# Altium project RobotCtrl.PrjPcb
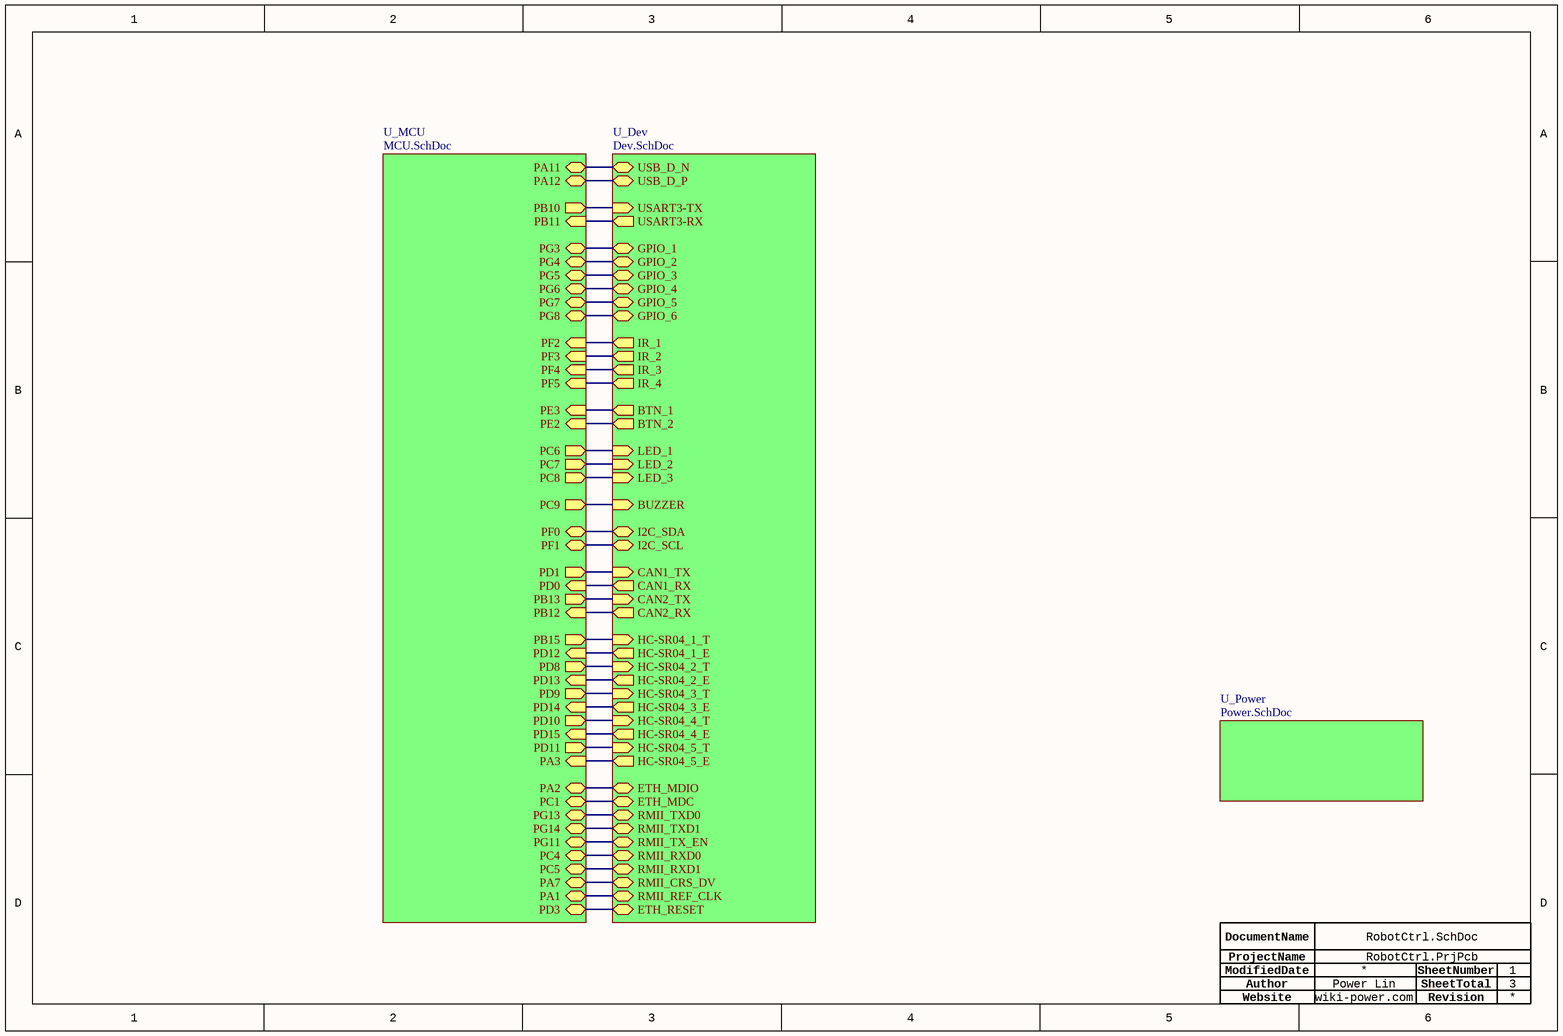
[diagram p0: RobotCtrl.SchDoc]
4 sheets, 127 parts. Net scope: hierarchical (ports join the sheet entries above them; power ports are global).
Board file: RobotCtrl.PcbDoc
Sheets:
  RobotCtrl.SchDoc
    U_Dev = Dev.SchDoc
    U_MCU = MCU.SchDoc
    U_Power = Power.SchDoc

## Sheet RobotCtrl.SchDoc
size 292 x 193 mm; Author: Power Lin; DocumentNumber: 2; SheetNumber: 1; SheetTotal: 3; Website: wiki-power.com

### Sub-sheets
U_Dev = Dev.SchDoc: USB_D_N (bidir), USB_D_P (bidir), USART3-TX (in), USART3-RX (out), GPIO_1 (bidir), GPIO_2 (bidir), GPIO_3 (bidir), GPIO_4 (bidir), GPIO_5 (bidir), GPIO_6 (bidir), BTN_1 (out), BTN_2 (out), LED_1 (in), LED_2 (in), LED_3 (in), IR_1 (out), IR_2 (out), IR_3 (out), IR_4 (out), BUZZER (in), I2C_SDA (bidir), I2C_SCL (bidir), CAN2_TX (in), CAN1_RX (out), CAN1_TX (in), CAN2_RX (out), HC-SR04_1_E (out), HC-SR04_2_T (in), HC-SR04_1_T (in), HC-SR04_5_E (out), HC-SR04_4_E (out), HC-SR04_5_T (in), HC-SR04_2_E (out), HC-SR04_4_T (in), HC-SR04_3_E (out), HC-SR04_3_T (in), RMII_TX_EN (bidir), RMII_TXD0 (bidir), ETH_RESET (bidir), RMII_TXD1 (bidir), RMII_RXD0 (bidir), RMII_RXD1 (bidir), ETH_MDIO (bidir), RMII_CRS_DV (bidir), ETH_MDC (bidir), RMII_REF_CLK (bidir)
U_MCU = MCU.SchDoc: PA11 (bidir), PA12 (bidir), PB11 (in), PB10 (out), PG8 (bidir), PG6 (bidir), PG5 (bidir), PG7 (bidir), PG4 (bidir), PG3 (bidir), PF3 (in), PF2 (in), PF5 (in), PF4 (in), PE3 (in), PE2 (in), PC7 (out), PC6 (out), PC8 (out), PC9 (out), PF0 (bidir), PF1 (bidir), PD0 (in), PB13 (out), PB12 (in), PD1 (out), PD10 (out), PA3 (in), PD8 (out), PD12 (in), PD15 (in), PD13 (in), PD11 (out), PD9 (out), PD14 (in), PB15 (out), PG11 (bidir), PC1 (bidir), PA7 (bidir), PA1 (bidir), PA2 (bidir), PG14 (bidir), PC4 (bidir), PD3 (bidir), PC5 (bidir), PG13 (bidir)
U_Power = Power.SchDoc: no entries

### Nets
USB_D_N: sheet U_Dev/USB_D_N, sheet U_MCU/PA11
USB_D_P: sheet U_Dev/USB_D_P, sheet U_MCU/PA12
NetC41_2: sheet U_Dev/BTN_1, sheet U_MCU/PE3
NetC45_2: sheet U_Dev/BTN_2, sheet U_MCU/PE2
NetIC2_9: sheet U_Dev/USART3-RX, sheet U_MCU/PB11
NetIC2_10: sheet U_Dev/USART3-TX, sheet U_MCU/PB10
NetIC3_7: sheet U_Dev/RMII_RXD1, sheet U_MCU/PC5
NetIC3_8: sheet U_Dev/RMII_RXD0, sheet U_MCU/PC4
NetIC3_11: sheet U_Dev/RMII_CRS_DV, sheet U_MCU/PA7
NetIC3_13: sheet U_Dev/ETH_MDC, sheet U_MCU/PC1
NetIC3_14: sheet U_Dev/RMII_REF_CLK, sheet U_MCU/PA1
NetIC3_15: sheet U_Dev/ETH_RESET, sheet U_MCU/PD3
NetIC3_16: sheet U_Dev/RMII_TX_EN, sheet U_MCU/PG11
NetIC3_17: sheet U_Dev/RMII_TXD0, sheet U_MCU/PG13
NetIC3_18: sheet U_Dev/RMII_TXD1, sheet U_MCU/PG14
NetP4_2: sheet U_Dev/HC-SR04_1_T, sheet U_MCU/PB15
NetP4_3: sheet U_Dev/HC-SR04_1_E, sheet U_MCU/PD12
NetP5_2: sheet U_Dev/HC-SR04_2_T, sheet U_MCU/PD8
NetP5_3: sheet U_Dev/HC-SR04_2_E, sheet U_MCU/PD13
NetP6_2: sheet U_Dev/HC-SR04_3_T, sheet U_MCU/PD9
NetP6_3: sheet U_Dev/HC-SR04_3_E, sheet U_MCU/PD14
NetP7_2: sheet U_Dev/HC-SR04_4_T, sheet U_MCU/PD10
NetP7_3: sheet U_Dev/HC-SR04_4_E, sheet U_MCU/PD15
NetP8_2: sheet U_Dev/HC-SR04_5_T, sheet U_MCU/PD11
NetP8_3: sheet U_Dev/HC-SR04_5_E, sheet U_MCU/PA3
NetP11_1: sheet U_Dev/IR_1, sheet U_MCU/PF2
NetP11_2: sheet U_Dev/IR_2, sheet U_MCU/PF3
NetP11_3: sheet U_Dev/IR_3, sheet U_MCU/PF4
NetP11_4: sheet U_Dev/IR_4, sheet U_MCU/PF5
NetP13_1: sheet U_Dev/GPIO_1, sheet U_MCU/PG3
NetP13_2: sheet U_Dev/GPIO_2, sheet U_MCU/PG4
NetP13_3: sheet U_Dev/GPIO_3, sheet U_MCU/PG5
NetP13_4: sheet U_Dev/GPIO_4, sheet U_MCU/PG6
NetP13_5: sheet U_Dev/GPIO_5, sheet U_MCU/PG7
NetP13_6: sheet U_Dev/GPIO_6, sheet U_MCU/PG8
NetR8_2: sheet U_Dev/ETH_MDIO, sheet U_MCU/PA2
NetR14_1: sheet U_Dev/BUZZER, sheet U_MCU/PC9
NetR15_1: sheet U_Dev/I2C_SCL, sheet U_MCU/PF1
NetR16_1: sheet U_Dev/I2C_SDA, sheet U_MCU/PF0
NetR22_2: sheet U_Dev/LED_1, sheet U_MCU/PC6
NetR27_2: sheet U_Dev/LED_2, sheet U_MCU/PC7
NetR28_2: sheet U_Dev/LED_3, sheet U_MCU/PC8
NetU1_73: sheet U_Dev/CAN2_RX, sheet U_MCU/PB12
NetU1_74: sheet U_Dev/CAN2_TX, sheet U_MCU/PB13
NetU1_114: sheet U_Dev/CAN1_RX, sheet U_MCU/PD0
NetU1_115: sheet U_Dev/CAN1_TX, sheet U_MCU/PD1

### Notes on the sheet
- Author
- DocumentName
- ModifiedDate
- ProjectName
- SheetNumber
- SheetTotal
- Website
- Revision

## Sheet Dev.SchDoc
size 292 x 193 mm; Author: Power Lin; DocumentNumber: 4; SheetNumber: 4; SheetTotal: 3; Website: wiki-power.com
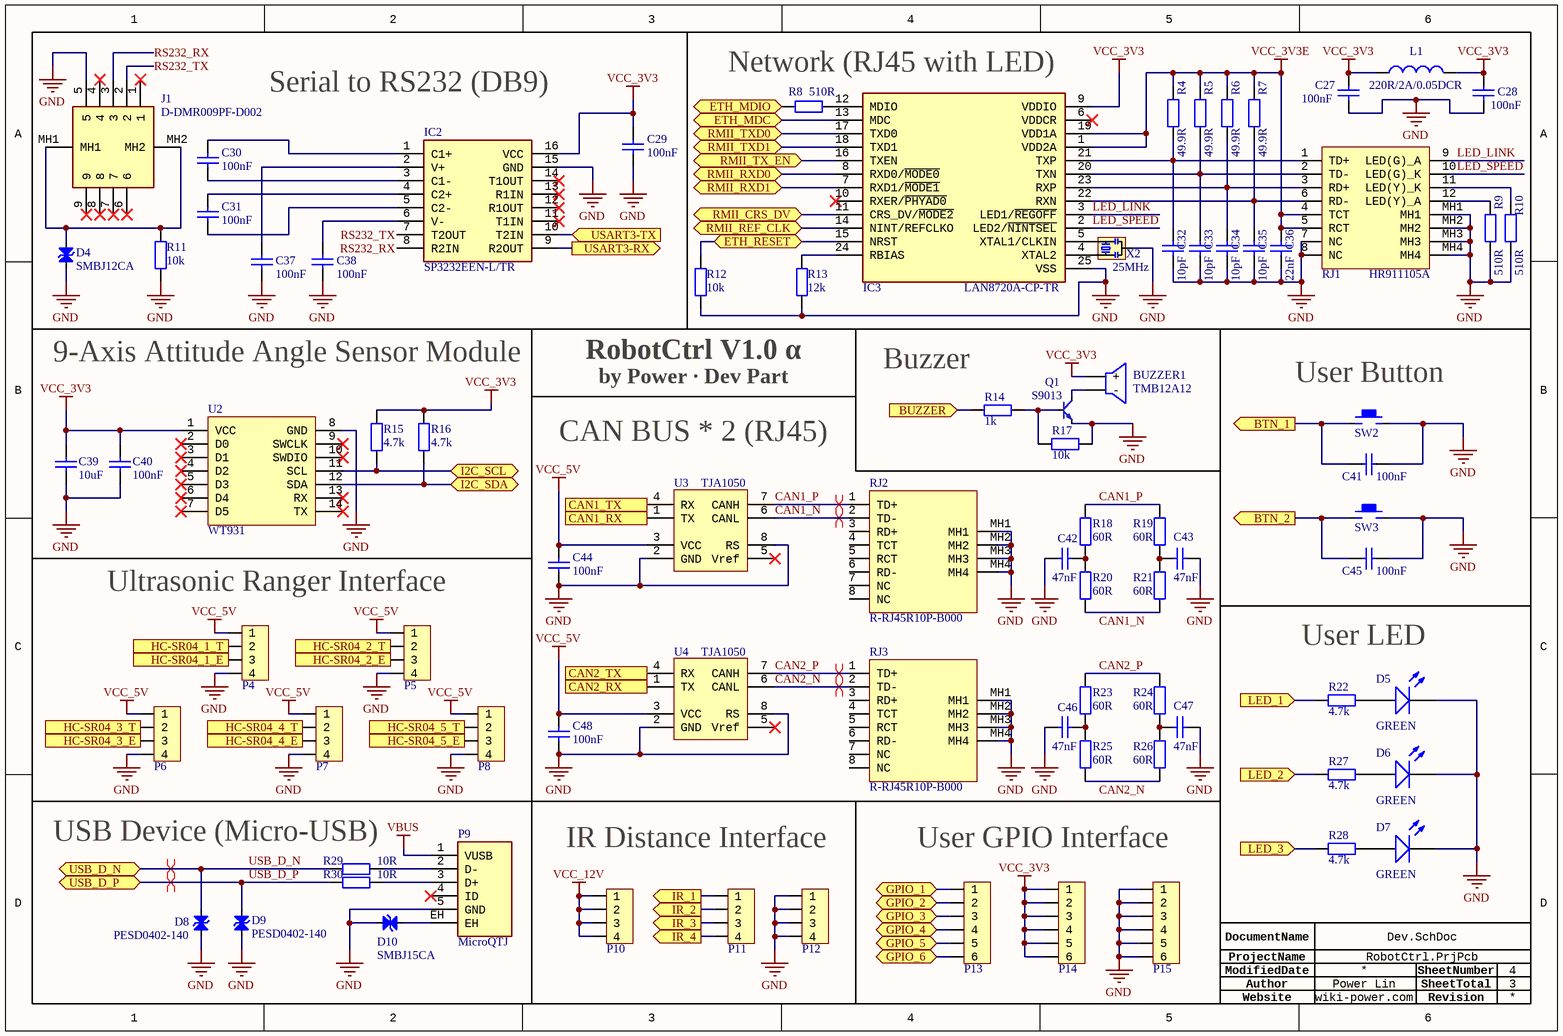
[diagram p1: Dev.SchDoc]

### Parts
BUZZER1  TMB12A12  [DIP,P=7.6mm]
C27  100nF  [CAP-0603]
C28  100nF  [CAP-0603]
C29  100nF  [CAP-0603]
C30  100nF  [CAP-0603]
C31  100nF  [CAP-0603]
C32  10pF  [CAP-0603]
C33  10pF  [CAP-0603]
C34  10pF  [CAP-0603]
C35  10pF  [CAP-0603]
C36  22nF  [CAP-0603]
C37  100nF  [CAP-0603]
C38  100nF  [CAP-0603]
C39  10uF  [CAP-0603]
C40  100nF  [CAP-0603]
C41  100nF  [CAP-0603]
C42  47nF  [CAP-0603]
C43  47nF  [CAP-0603]
C44  100nF  [CAP-0603]
C45  100nF  [CAP-0603]
C46  47nF  [CAP-0603]
C47  47nF  [CAP-0603]
C48  100nF  [CAP-0603]
D4  SMBJ12CA  [DO-214AA/SMB]
D5  GREEN  [LED-0603]
D6  GREEN  [LED-0603]
D7  GREEN  [LED-0603]
D8  PESD0402-140  [D-0402]
D9  PESD0402-140  [D-0402]
D10  SMBJ15CA  [DO-214AA/SMB]
IC2  SP3232EEN-L/TR  [SOIC-16_150mil]
IC3  LAN8720A-CP-TR  [QFN-24-4x4]
J1  D-DMR009PF-D002  [Through Hole,P=2.77mm]
L1  220R/2A/0.05DCR  [L-0603]
P4  HDR1x4_2.54  [HDR1x4_2.54_180]  (value not drawn)
P5  HDR1x4_2.54  [HDR1x4_2.54_180]  (value not drawn)
P6  HDR1x4_2.54  [HDR1x4_2.54_180]  (value not drawn)
P7  HDR1x4_2.54  [HDR1x4_2.54_180]  (value not drawn)
P8  HDR1x4_2.54  [HDR1x4_2.54_180]  (value not drawn)
P9  MicroQTJ  [USB-MICRO]
P10  HDR1x4_2.54  [HDR1x4_2.54_180]  (value not drawn)
P11  HDR1x4_2.54  [HDR1x4_2.54_180]  (value not drawn)
P12  HDR1x4_2.54  [HDR1x4_2.54_180]  (value not drawn)
P13  HDR1x6  [HDR1X6_2.54_180]  (value not drawn)
P14  HDR1x6  [HDR1X6_2.54_180]  (value not drawn)
P15  HDR1x6  [HDR1X6_2.54_180]  (value not drawn)
Q1  S9013  [SOT-23-3]
R4  49.9R  [R-0603]
R5  49.9R  [R-0603]
R6  49.9R  [R-0603]
R7  49.9R  [R-0603]
R8  510R  [R-0603]
R9  510R  [R-0603]
R10  510R  [R-0603]
R11  10k  [R-0603]
R12  10k  [R-0603]
R13  12k  [R-0603]
R14  1k  [R-0603]
R15  4.7k  [R-0603]
R16  4.7k  [R-0603]
R17  10k  [R-0603]
R18  60R  [R-0603]
R19  60R  [R-0603]
R20  60R  [R-0603]
R21  60R  [R-0603]
R22  4.7k  [R-0603]
R23  60R  [R-0603]
R24  60R  [R-0603]
R25  60R  [R-0603]
R26  60R  [R-0603]
R27  4.7k  [R-0603]
R28  4.7k  [R-0603]
R29  10R  [R-0603]
R30  10R  [R-0603]
RJ1  HR911105A  [HR911105A]
RJ2  R-RJ45R10P-B000  [RRJ45R10PB000]
RJ3  R-RJ45R10P-B000  [RRJ45R10PB000]
SW2  KEY  [KEY-4P-4.2*3.4*2.5]  (value not drawn)
SW3  KEY  [KEY-4P-4.2*3.4*2.5]  (value not drawn)
U2  WT931  [WT931]
U3  TJA1050  [SOIC_8]
U4  TJA1050  [SOIC_8]
X2  25MHz  [SMD3213-3P]

### Ports
BTN_1 (out), BTN_2 (out), BUZZER (in), CAN1_RX (out), CAN1_TX (in), CAN2_RX (out), CAN2_TX (in), ETH_MDC (bidir), ETH_MDIO (bidir), ETH_RESET (bidir), GPIO_1 (bidir), GPIO_2 (bidir), GPIO_3 (bidir), GPIO_4 (bidir), GPIO_5 (bidir), GPIO_6 (bidir), HC-SR04_1_E (out), HC-SR04_1_T (in), HC-SR04_2_E (out), HC-SR04_2_T (in), HC-SR04_3_E (out), HC-SR04_3_T (in), HC-SR04_4_E (out), HC-SR04_4_T (in), HC-SR04_5_E (out), HC-SR04_5_T (in), I2C_SCL (bidir), I2C_SDA (bidir), IR_1 (out), IR_2 (out), IR_3 (out), IR_4 (out), LED_1 (in), LED_2 (in), LED_3 (in), RMII_CRS_DV (bidir), RMII_REF_CLK (bidir), RMII_RXD0 (bidir), RMII_RXD1 (bidir), RMII_TX_EN (bidir), RMII_TXD0 (bidir), RMII_TXD1 (bidir), USART3-RX (out), USART3-TX (in), USB_D_N (bidir), USB_D_P (bidir)

### Nets
GND: C27.1 C28.1 C29.1 C32.1 C33.1 C34.1 C35.1 C36.1 C37.1 C38.1 C39.2 C40.2 C41.1 C42.2 C43.2 C44.1 C45.1 C46.2 C47.2 C48.1 D4.1 D5.K D6.K D7.K D8.1 D9.1 D10.2 IC2.15(GND) IC3.25(VSS) J1.5 P4.4 P5.4 P6.4 P7.4 P8.4 P9.5(GND) P12.1 P12.2 P12.3 P12.4 P15.1 P15.2 P15.3 P15.4 P15.5 P15.6 Q1.2(E) R9.1 R10.1 R11.1 R12.2 R13.2 R17.1 RJ1.7(NC) RJ1.8(NC) RJ1.MH1 RJ1.MH2 RJ1.MH3 RJ1.MH4 RJ2.MH1 RJ2.MH2 RJ2.MH3 RJ2.MH4 RJ3.MH1 RJ3.MH2 RJ3.MH3 RJ3.MH4 SW2.2 SW3.2 U2.8(GND) U3.2(GND) U3.8(RS) U4.2(GND) U4.8(RS) X2.2(GND)
VBUS: C44.2 C48.2 P4.1 P5.1 P6.1 P7.1 P8.1 P9.1(VUSB) U3.3(VCC) U4.3(VCC)  [also labelled VCC_5V]
VCC_3V3: BUZZER1.1(+) C27.2 C28.2 C29.2 C39.1 C40.1 IC2.16(VCC) IC3.9(VDDIO) L1.1 L1.2 P14.1 P14.2 P14.3 P14.4 P14.5 P14.6 R15.2 R16.2 U2.1(VCC)
VCC_3V3E: C36.2 IC3.1(VDD2A) IC3.19(VDD1A) R4.2 R5.2 R6.2 R7.2 RJ1.4(TCT) RJ1.5(RCT)
VCC_12V: P10.1 P10.2 P10.3 P10.4
CAN1_N: R20.2 R21.1 RJ2.2(TD-) U3.6(CANL)
CAN1_P: R18.1 R19.2 RJ2.1(TD+) U3.7(CANH)
CAN2_N: R25.2 R26.1 RJ3.2(TD-) U4.6(CANL)
CAN2_P: R23.1 R24.2 RJ3.1(TD+) U4.7(CANH)
LED_LINK: IC3.3(LED1/~{REGOFF}) RJ1.9(LED(G)_A)
LED_SPEED: IC3.2(LED2/~{NINTSEL}) RJ1.10(LED(G)_K)
RS232_RX: IC2.8(R2IN) J1.3
RS232_TX: IC2.7(T2OUT) J1.2
USB_D_N: D8.2 R29.1 ; port USB_D_N
USB_D_P: D9.2 R30.1 ; port USB_D_P
NetBUZZER1_2: BUZZER1.2(-) Q1.3(C)
NetC30_1: C30.1 IC2.3(C1-)
NetC30_2: C30.2 IC2.1(C1+)
NetC31_1: C31.1 IC2.5(C2-)
NetC31_2: C31.2 IC2.4(C2+)
NetC32_2: C32.2 IC3.21(TXP) R4.1 RJ1.1(TD+)
NetC33_2: C33.2 IC3.20(TXN) R5.1 RJ1.2(TD-)
NetC34_2: C34.2 IC3.23(RXP) R6.1 RJ1.3(RD+)
NetC35_2: C35.2 IC3.22(RXN) R7.1 RJ1.6(RD-)
NetC37_2: C37.2 IC2.2(V+)
NetC38_2: C38.2 IC2.6(V-)
NetC41_2: C41.2 SW2.1 ; port BTN_1
NetC42_1: C42.1 R18.2 R20.1
NetC43_1: C43.1 R19.1 R21.2
NetC45_2: C45.2 SW3.1 ; port BTN_2
NetC46_1: C46.1 R23.2 R25.1
NetC47_1: C47.1 R24.1 R26.2
NetD4_2: D4.2 J1.MH1 J1.MH2 R11.2
NetD5_A: D5.A R22.1
NetD6_A: D6.A R27.1
NetD7_A: D7.A R28.1
NetD10_1: D10.1 P9.EH
NetIC2_9: IC2.9(R2OUT) ; port USART3-RX
NetIC2_10: IC2.10(T2IN) ; port USART3-TX
NetIC3_4: IC3.4(XTAL2) X2.1(OSC1)
NetIC3_5: IC3.5(XTAL1/CLKIN) X2.3(OSC2)
NetIC3_7: IC3.7(RXD1/~{MODE1}) ; port RMII_RXD1
NetIC3_8: IC3.8(RXD0/~{MODE0}) ; port RMII_RXD0
NetIC3_11: IC3.11(CRS_DV/~{MODE2}) ; port RMII_CRS_DV
NetIC3_12: IC3.12(MDIO) R8.1
NetIC3_13: IC3.13(MDC) ; port ETH_MDC
NetIC3_14: IC3.14(NINT/REFCLKO) ; port RMII_REF_CLK
NetIC3_15: IC3.15(NRST) R12.1 ; port ETH_RESET
NetIC3_16: IC3.16(TXEN) ; port RMII_TX_EN
NetIC3_17: IC3.17(TXD0) ; port RMII_TXD0
NetIC3_18: IC3.18(TXD1) ; port RMII_TXD1
NetIC3_24: IC3.24(RBIAS) R13.1
NetP4_2: P4.2 ; port HC-SR04_1_T
NetP4_3: P4.3 ; port HC-SR04_1_E
NetP5_2: P5.2 ; port HC-SR04_2_T
NetP5_3: P5.3 ; port HC-SR04_2_E
NetP6_2: P6.2 ; port HC-SR04_3_T
NetP6_3: P6.3 ; port HC-SR04_3_E
NetP7_2: P7.2 ; port HC-SR04_4_T
NetP7_3: P7.3 ; port HC-SR04_4_E
NetP8_2: P8.2 ; port HC-SR04_5_T
NetP8_3: P8.3 ; port HC-SR04_5_E
NetP9_2: P9.2(D-) R29.2
NetP9_3: P9.3(D+) R30.2
NetP11_1: P11.1 ; port IR_1
NetP11_2: P11.2 ; port IR_2
NetP11_3: P11.3 ; port IR_3
NetP11_4: P11.4 ; port IR_4
NetP13_1: P13.1 ; port GPIO_1
NetP13_2: P13.2 ; port GPIO_2
NetP13_3: P13.3 ; port GPIO_3
NetP13_4: P13.4 ; port GPIO_4
NetP13_5: P13.5 ; port GPIO_5
NetP13_6: P13.6 ; port GPIO_6
NetQ1_1: Q1.1(B) R14.2 R17.2
NetR8_2: R8.2 ; port ETH_MDIO
NetR9_2: R9.2 RJ1.12(LED(Y)_A)
NetR10_2: R10.2 RJ1.11(LED(Y)_K)
NetR14_1: R14.1 ; port BUZZER
NetR15_1: R15.1 U2.11(SCL) ; port I2C_SCL
NetR16_1: R16.1 U2.12(SDA) ; port I2C_SDA
NetR22_2: R22.2 ; port LED_1
NetR27_2: R27.2 ; port LED_2
NetR28_2: R28.2 ; port LED_3
NetU1_73: U4.1(TX) ; port CAN2_RX
NetU1_74: U4.4(RX) ; port CAN2_TX
NetU1_114: U3.1(TX) ; port CAN1_RX
NetU1_115: U3.4(RX) ; port CAN1_TX

Not connected (* = marked no-connect by the designer): IC2 11(T1IN)* 12(R1OUT)* 13(R1IN)* 14(T1OUT)*; IC3 6(VDDCR)* 10(RXER/~{PHYAD0})*; J1 1* 4* 6* 7* 8* 9*; P9 4(ID)*; RJ2 3(RD+) 4(TCT) 5(RCT) 6(RD-) 7(NC) 8(NC); RJ3 3(RD+) 4(TCT) 5(RCT) 6(RD-) 7(NC) 8(NC); U2 2(D0)* 3(D1)* 4(D2)* 5(D3)* 6(D4)* 7(D5)* 9(SWCLK)* 10(SWDIO)* 13(RX)* 14(TX)*; U3 5(Vref)*; U4 5(Vref)*

### Layout directives
differential pair: CAN1_N, CAN1_P, CAN2_N, CAN2_P, USB_D_N, USB_D_P

### Notes on the sheet
- Serial to RS232 (DB9)
- Network (RJ45 with LED)
- 9-Axis Attitude Angle Sensor Module
- RobotCtrl V1.0 α
- by Power · Dev Part
- (near R14) Buzzer
- (near SW2) User Button
- CAN BUS * 2 (RJ45)
- Ultrasonic Ranger Interface
- User LED
- USB Device (Micro-USB)
- IR Distance Interface
- User GPIO Interface
- Author
- DocumentName
- ModifiedDate
- ProjectName
- SheetNumber
- SheetTotal
- Website
- Revision

### Library data of the parts
BUZZER1 = BUZZER: TMB12A12 有源蜂鸣器
C27-C48 = CAP: 贴片电容; ComponentLink1Description: 供应商链接; ComponentLink1URL: http://www.szlcsc.com/product/details_53938.html; Package: 0402; Supplier: LC; SuppliersPartNumber: C52923
D4 D8-D10 = TVS_C
D5-D7 = LED: 发光二极管; pin to pad: A>1 K>2; ComponentLink1Description: 供应商链接; ComponentLink1URL: http://www.szlcsc.com/product/details_2663.html; Package: 0603; Supplier: LC; SuppliersPartNumber: C2290
IC2 = SP3232EEN: RS232 芯片; Manufacturer_Name: MaxLinear; Datasheet Link: https://www.maxlinear.com/ds/sp3222e_sp3232e.pdf; Height: 1.75mm; Manufacturer_Part_Number: SP3232EEN-L/TR; Mouser Part Number: 701-SP3232EEN-L/TR; Mouser Price/Stock: https://www.mouser.co.uk/ProductDetail/MaxLinear/SP3232EEN-L-TR?qs=Hy8V1%2FADhVKNh9v9NvoeCw%3D%3D; Arrow Part Number: SP3232EEN-L/TR; Arrow Price/Stock: https://www.arrow.com/en/products/sp3232een-ltr/maxlinear-inc
IC3 = LAN8720A-CP-TR: Integrated Circuit; Manufacturer_Name: Microchip; Description: Ethernet ICs RMII 10/100 ETH XCVR w/HP AutoMDIXSupport; Datasheet Link: https://componentsearchengine.com/Datasheets/1/LAN8720A-CP-TR.pdf; Height: 1mm; Manufacturer_Part_Number: LAN8720A-CP-TR; Mouser Part Number: 886-LAN8720A-CP-TR; Mouser Price/Stock: https://www.mouser.co.uk/ProductDetail/Microchip-Technology/LAN8720A-CP-TR?qs=pA5MXup5wxG3QiSvrqf%2FHQ%3D%3D; Arrow Part Number: LAN8720A-CP-TR; Arrow Price/Stock: https://www.arrow.com/en/products/lan8720a-cp-tr/microchip-technology?region=nac
J1 = DB9: D-Sub 连接器; Manufacturer_Name: TE Connectivity; Manufacturer_Part_Number: 5747844-5; Datasheet Link: http://www.te.com/commerce/DocumentDelivery/DDEController?Action=srchrtrv&DocNm=82068_AMPLIMITE_Right-Angle_Posted_Conn&DocType=Catalog+Section&DocLang=English&PartCntxt=; Height: 12.9286mm; Mouser Part Number: 571-5747844-5; Mouser Price/Stock: https://www.mouser.co.uk/ProductDetail/TE-Connectivity/5747844-5?qs=x6EjVpvqMVPrkQsJHUlJGw%3D%3D; Arrow Part Number: 5747844-5; Arrow Price/Stock: https://www.arrow.com/en/products/5747844-5/te-connectivity
L1 = BEAD: BLM18KG221SN1D; ComponentLink1Description: 供应商链接; ComponentLink1URL: http://www.szlcsc.com/product/details_33003.html; Package: 0402; Supplier: LC; SuppliersPartNumber: C32041
P4-P8 P10-P12 = HDR1x4_2.54: Header
P9 = USB_MICRO
P13-P15 = HDR1x6_2.54: Header
Q1 = BJT_NPN
R4-R30 = RES: 贴片电阻; Package: 0805; Supplier: LC; SuppliersPartNumber: C17798
RJ1 = RJ45_LED
RJ2 RJ3 = RJ45
SW2 SW3 = KEY: 按键开关
U2 = WT931: 陀螺仪模组
U3 U4 = TJA1050: CAN 控制器（5V）
X2 = XTAL: CSTCE25M00G51-R0

## Sheet MCU.SchDoc
size 292 x 193 mm; Author: Power Lin; DocumentNumber: 3; SheetNumber: 3; SheetTotal: 3; Website: wiki-power.com
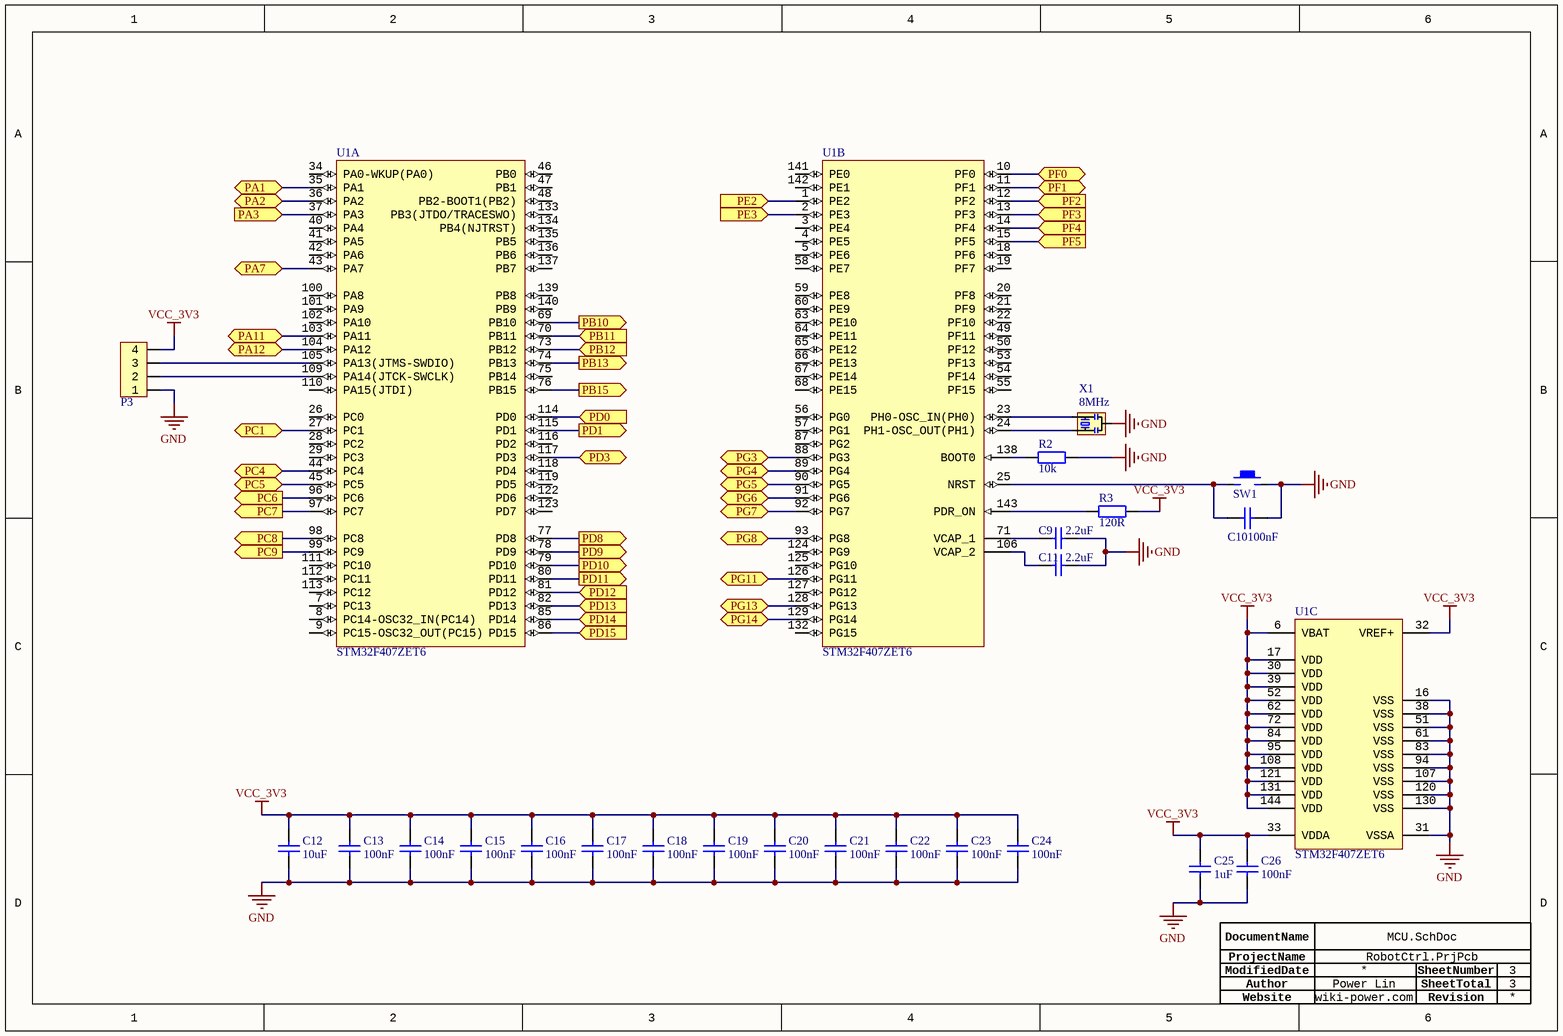
[diagram p2: MCU.SchDoc]

### Parts
C9  2.2uF  [CAP-0603]
C10  100nF  [CAP-0603]
C11  2.2uF  [CAP-0603]
C12  10uF  [CAP-0603]
C13  100nF  [CAP-0603]
C14  100nF  [CAP-0603]
C15  100nF  [CAP-0603]
C16  100nF  [CAP-0603]
C17  100nF  [CAP-0603]
C18  100nF  [CAP-0603]
C19  100nF  [CAP-0603]
C20  100nF  [CAP-0603]
C21  100nF  [CAP-0603]
C22  100nF  [CAP-0603]
C23  100nF  [CAP-0603]
C24  100nF  [CAP-0603]
C25  1uF  [CAP-0603]
C26  100nF  [CAP-0603]
P3  HDR1x4_2.54  [HDR1x4_2.54_180]  (value not drawn)
R2  10k  [R-0603]
R3  120R  [R-0603]
SW1  KEY  [KEY-4P-4.2*3.4*2.5]  (value not drawn)
U1  STM32F407ZET6  [STM-LQFP144_N]  (parts A,B,C of 3)
X1  8MHz  [SMD3213-3P]

### Ports
PA1 (bidir), PA2 (bidir), PA3 (in), PA7 (bidir), PA11 (bidir), PA12 (bidir), PB10 (out), PB11 (in), PB12 (in), PB13 (out), PB15 (out), PC1 (bidir), PC4 (bidir), PC5 (bidir), PC6 (out), PC7 (out), PC8 (out), PC9 (out), PD0 (in), PD1 (out), PD3 (bidir), PD8 (out), PD9 (out), PD10 (out), PD11 (out), PD12 (in), PD13 (in), PD14 (in), PD15 (in), PE2 (in), PE3 (in), PF0 (bidir), PF1 (bidir), PF2 (in), PF3 (in), PF4 (in), PF5 (in), PG3 (bidir), PG4 (bidir), PG5 (bidir), PG6 (bidir), PG7 (bidir), PG8 (bidir), PG11 (bidir), PG13 (bidir), PG14 (bidir)

### Nets
GND: C9.2 C10.1 C11.2 C12.1 C13.1 C14.1 C15.1 C16.1 C17.1 C18.1 C19.1 C20.1 C21.1 C22.1 C23.1 C24.1 C25.1 C26.1 P3.1 R2.1 SW1.2 U1.16(VSS) U1.31(VSSA) U1.38(VSS) U1.51(VSS) U1.61(VSS) U1.83(VSS) U1.94(VSS) U1.107(VSS) U1.120(VSS) U1.130(VSS) X1.2(GND)
VCC_3V3: C12.2 C13.2 C14.2 C15.2 C16.2 C17.2 C18.2 C19.2 C20.2 C21.2 C22.2 C23.2 C24.2 C25.2 C26.2 P3.4 R3.1 U1.6(VBAT) U1.17(VDD) U1.30(VDD) U1.32(VREF+) U1.33(VDDA) U1.39(VDD) U1.52(VDD) U1.62(VDD) U1.72(VDD) U1.84(VDD) U1.95(VDD) U1.108(VDD) U1.121(VDD) U1.131(VDD) U1.144(VDD)
USB_D_N: U1.103(PA11) ; port PA11
USB_D_P: U1.104(PA12) ; port PA12
NetC9_1: C9.1 U1.71(VCAP_1)
NetC10_2: C10.2 SW1.1 U1.25(NRST)
NetC11_1: C11.1 U1.106(VCAP_2)
NetC41_2: U1.2(PE3) ; port PE3
NetC45_2: U1.1(PE2) ; port PE2
NetIC2_9: U1.70(PB11) ; port PB11
NetIC2_10: U1.69(PB10) ; port PB10
NetIC3_7: U1.45(PC5) ; port PC5
NetIC3_8: U1.44(PC4) ; port PC4
NetIC3_11: U1.43(PA7) ; port PA7
NetIC3_13: U1.27(PC1) ; port PC1
NetIC3_14: U1.35(PA1) ; port PA1
NetIC3_15: U1.117(PD3) ; port PD3
NetIC3_16: U1.126(PG11) ; port PG11
NetIC3_17: U1.128(PG13) ; port PG13
NetIC3_18: U1.129(PG14) ; port PG14
NetP3_2: P3.2 U1.109(PA14(JTCK-SWCLK))
NetP3_3: P3.3 U1.105(PA13(JTMS-SWDIO))
NetP4_2: U1.76(PB15) ; port PB15
NetP4_3: U1.81(PD12) ; port PD12
NetP5_2: U1.77(PD8) ; port PD8
NetP5_3: U1.82(PD13) ; port PD13
NetP6_2: U1.78(PD9) ; port PD9
NetP6_3: U1.85(PD14) ; port PD14
NetP7_2: U1.79(PD10) ; port PD10
NetP7_3: U1.86(PD15) ; port PD15
NetP8_2: U1.80(PD11) ; port PD11
NetP8_3: U1.37(PA3) ; port PA3
NetP11_1: U1.12(PF2) ; port PF2
NetP11_2: U1.13(PF3) ; port PF3
NetP11_3: U1.14(PF4) ; port PF4
NetP11_4: U1.15(PF5) ; port PF5
NetP13_1: U1.88(PG3) ; port PG3
NetP13_2: U1.89(PG4) ; port PG4
NetP13_3: U1.90(PG5) ; port PG5
NetP13_4: U1.91(PG6) ; port PG6
NetP13_5: U1.92(PG7) ; port PG7
NetP13_6: U1.93(PG8) ; port PG8
NetR2_2: R2.2 U1.138(BOOT0)
NetR3_2: R3.2 U1.143(PDR_ON)
NetR8_2: U1.36(PA2) ; port PA2
NetR14_1: U1.99(PC9) ; port PC9
NetR15_1: U1.11(PF1) ; port PF1
NetR16_1: U1.10(PF0) ; port PF0
NetR22_2: U1.96(PC6) ; port PC6
NetR27_2: U1.97(PC7) ; port PC7
NetR28_2: U1.98(PC8) ; port PC8
NetU1_23: U1.23(PH0-OSC_IN(PH0)) X1.3(OSC2)
NetU1_24: U1.24(PH1-OSC_OUT(PH1)) X1.1(OSC1)
NetU1_73: U1.73(PB12) ; port PB12
NetU1_74: U1.74(PB13) ; port PB13
NetU1_114: U1.114(PD0) ; port PD0
NetU1_115: U1.115(PD1) ; port PD1

Not connected (* = marked no-connect by the designer): U1 3(PE4) 4(PE5) 5(PE6) 7(PC13) 8(PC14-OSC32_IN(PC14)) 9(PC15-OSC32_OUT(PC15)) 18(PF6) 19(PF7) 20(PF8) 21(PF9) 22(PF10) 26(PC0) 28(PC2) 29(PC3) 34(PA0-WKUP(PA0)) 40(PA4) 41(PA5) 42(PA6) 46(PB0) 47(PB1) 48(PB2-BOOT1(PB2)) 49(PF11) 50(PF12) 53(PF13) 54(PF14) 55(PF15) 56(PG0) 57(PG1) 58(PE7) 59(PE8) 60(PE9) 63(PE10) 64(PE11) 65(PE12) 66(PE13) 67(PE14) 68(PE15) 75(PB14) 87(PG2) 100(PA8) 101(PA9) 102(PA10) 110(PA15(JTDI)) 111(PC10) 112(PC11) 113(PC12) 116(PD2) 118(PD4) 119(PD5) 122(PD6) 123(PD7) 124(PG9) 125(PG10) 127(PG12) 132(PG15) 133(PB3(JTDO/TRACESWO)) 134(PB4(NJTRST)) 135(PB5) 136(PB6) 137(PB7) 139(PB8) 140(PB9) 141(PE0) 142(PE1)

### Notes on the sheet
- Author
- DocumentName
- ModifiedDate
- ProjectName
- SheetNumber
- SheetTotal
- Website
- Revision

### Library data of the parts
C9-C26 = CAP: 贴片电容; ComponentLink1Description: 供应商链接; ComponentLink1URL: http://www.szlcsc.com/product/details_53938.html; Package: 0402; Supplier: LC; SuppliersPartNumber: C52923
P3 = HDR1x4_2.54: Header
R2 R3 = RES: 贴片电阻; Package: 0805; Supplier: LC; SuppliersPartNumber: C17798
SW1 = KEY: 按键开关
U1 = STM32F407ZET6: ARM Cortex-M4 32-bit MCU+FPU, 210 DMIPS, 512 kB Flash, 192 kB Internal RAM, 114 I/Os, 144-pin LQFP, -40 to 85 degC, Tray; Manufacturer: STMicroelectronics; D/A Converter: 2x12-bit; FLASH Size (Prog) (kB): 512; I/Os (High Current): 114; Internal RAM Size (kB): 192; Operating Frequency(F) (Processor speed) (MHz): 168; Supply Voltage(Vcc) max (V): 3.6; Supply Voltage(Vcc) min (V): 1.8; DatasheetVersion: Rev. 4; PackageVersion: Rev. 4, 06/2013; PackageReference: LQFP144; PackageDescription: 144-Pin Low Profile Quad Flat Package, 20 x 20 mm Body, 0.5 mm Pitch; Supplier 1: Digi-Key; Supplier Part Number 1: 497-11903-ND; Supplier 2: Farnell; Supplier Part Number 2: 2215229; Supplier 3: Newark; Supplier Part Number 3: 46W2203; Supplier 4: Newark; Supplier Part Number 4: 87T3795; Supplier 5: Mouser; Supplier Part Number 5: 511-STM32F407ZET6; Core: ARM Cortex-M4; Packing: Tray; Mounting Technology: Surface Mount; PartNumber: STM32F407ZET6; ComponentLink1Description: Manufacturer URL; ComponentLink1URL: http://www.st.com/web/en/home.html; ComponentLink2Description: Datasheet; ComponentLink2URL: http://www.st.com/st-web-ui/static/active/en/resource/technical/document/datasheet/DM00037051.pdf; ComponentLink3Description: Package Specification; ComponentLink3URL: http://www.st.com/st-web-ui/static/active/en/resource/technical/document/datasheet/DM00037051.pdf
X1 = XTAL: CSTCE8M00G15C99-R0

## Sheet Power.SchDoc
size 292 x 193 mm; Author: Power Lin; DocumentNumber: 1; SheetNumber: 2; SheetTotal: 4; Website: wiki-power.com
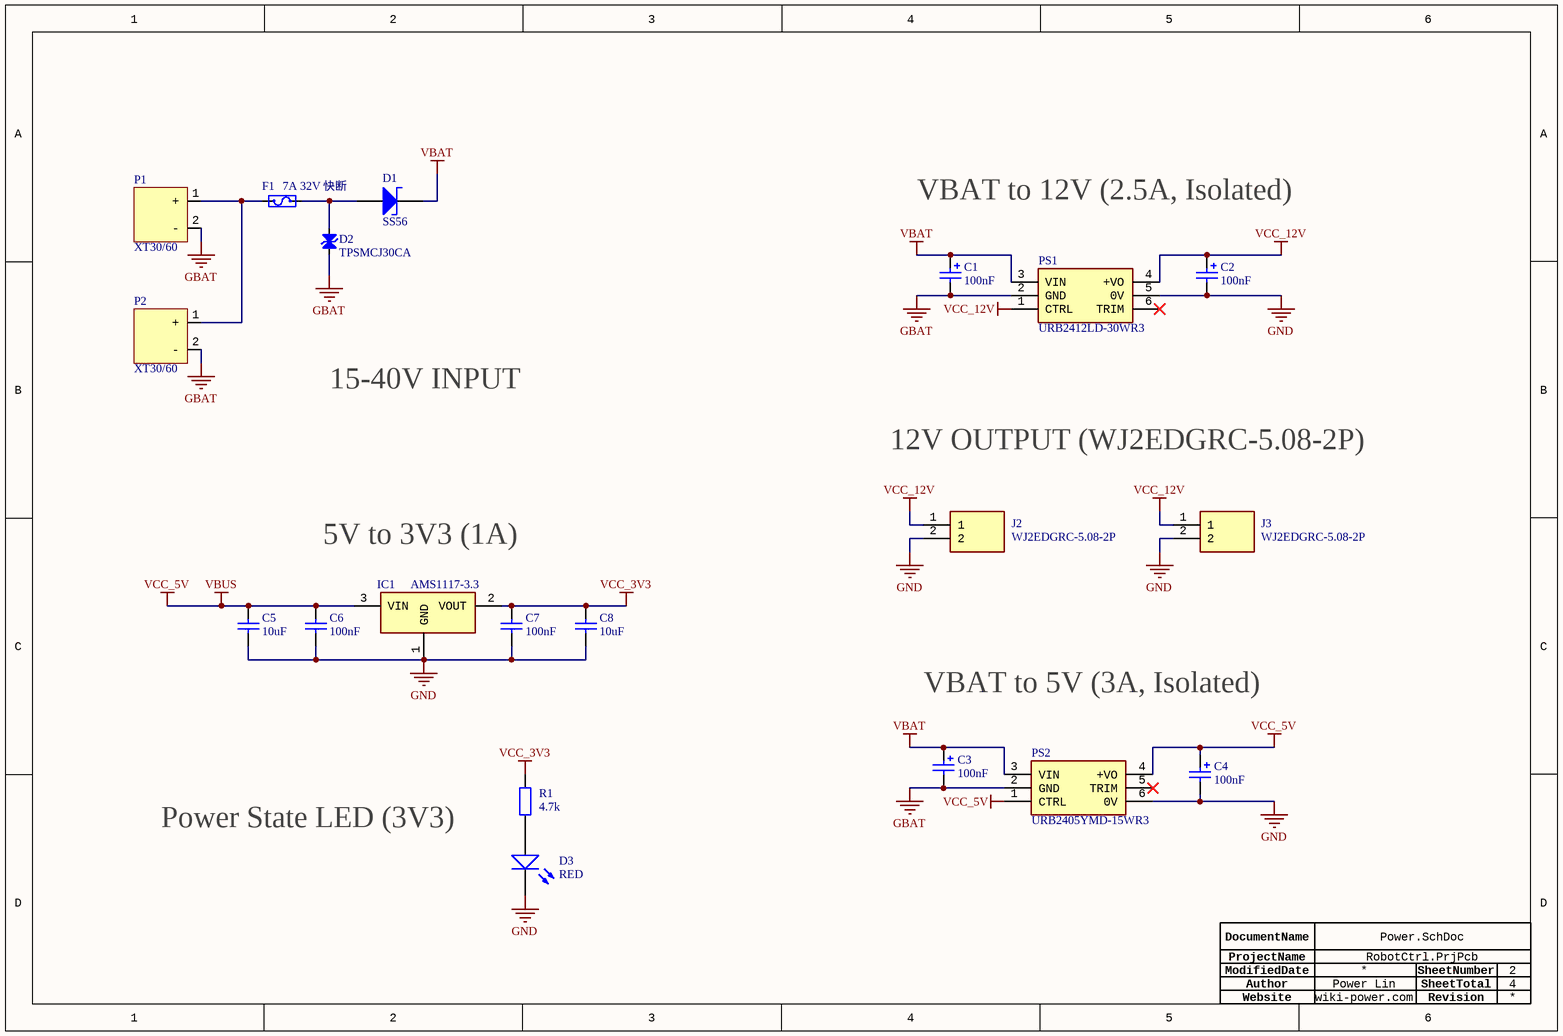
[diagram p3: Power.SchDoc]

### Parts
C1  100nF  [CAP-AUX-3216]
C2  100nF  [CAP-AUX-3216]
C3  100nF  [CAP-AUX-3216]
C4  100nF  [CAP-AUX-3216]
C5  10uF  [CAP-0603]
C6  100nF  [CAP-0603]
C7  100nF  [CAP-0603]
C8  10uF  [CAP-0603]
D1  SS56  [DO-214AB/SMC]
D2  TPSMCJ30CA  [DO-214AB/SMC]
D3  RED  [LED-0603]
F1  7A 32V 快断  [FUSE_1206]
IC1  AMS1117-3.3  [SOT-223]
J2  WJ2EDGRC-5.08-2P  [SHDRRA2W105P0X508_1X2_1206X1220X830P]
J3  WJ2EDGRC-5.08-2P  [SHDRRA2W105P0X508_1X2_1206X1220X830P]
P1  XT30/60  [XT60PW-M]
P2  XT30/60  [XT60PW-M]
PS1  URB2412LD-30WR3  [URB2412LD30WR3]
PS2  URB2405YMD-15WR3  [URB2405YMD15WR3]
R1  4.7k  [R-0603]

### Nets
GBAT: C1.2 C3.2 D2.1 P1.2(-) P2.2(-) PS1.2(GND) PS2.2(GND)
GND: C2.2 C4.2 C5.1 C6.1 C7.1 C8.1 D3.K IC1.1(GND) J2.2 J3.2 PS1.5(0V) PS2.6(0V)
VBAT: C1.1 C3.1 D1.2(K) PS1.3(VIN) PS2.3(VIN)
VBUS: C4.1 C5.2 C6.2 IC1.3(VIN) PS2.1(CTRL) PS2.4(+VO)  [also labelled VCC_5V]
VCC_3V3: C7.2 C8.2 IC1.2(VOUT) R1.2
VCC_12V: C2.1 J2.1 J3.1 PS1.1(CTRL) PS1.4(+VO)
NetD1_1: D1.1(A) D2.2 F1.2
NetD3_A: D3.A R1.1
NetF1_1: F1.1 P1.1(+) P2.1(+)

Not connected (* = marked no-connect by the designer): PS1 6(TRIM)*; PS2 5(TRIM)*

### Notes on the sheet
- VBAT to 12V (2.5A, Isolated)
- 15-40V INPUT
- 12V OUTPUT (WJ2EDGRC-5.08-2P)
- 5V to 3V3 (1A)
- VBAT to 5V (3A, Isolated)
- Power State LED (3V3)
- Author
- DocumentName
- ModifiedDate
- ProjectName
- SheetNumber
- SheetTotal
- Website
- Revision

### Library data of the parts
C1-C4 = CAP-POL: KM101M050F115A; ComponentLink1Description: 供应商链接; ComponentLink1URL: http://www.szlcsc.com/product/details_16815.html; Package: 3528; Supplier: LC; SuppliersPartNumber: C16133
C5-C8 = CAP: 贴片电容; ComponentLink1Description: 供应商链接; ComponentLink1URL: http://www.szlcsc.com/product/details_53938.html; Package: 0402; Supplier: LC; SuppliersPartNumber: C52923
D1 = DIODE_Schottky: 肖特基二极管
D2 = TVS_C
D3 = LED: 发光二极管; pin to pad: A>1 K>2; ComponentLink1Description: 供应商链接; ComponentLink1URL: http://www.szlcsc.com/product/details_2663.html; Package: 0603; Supplier: LC; SuppliersPartNumber: C2290
F1 = Fuse: 0437007.WR
IC1 = AMS1117: AMS1117-3.3 1.0A; Manufacturer_Name: Nexperia; Manufacturer_Part_Number: SI2302DS; Datasheet Link: https://assets.nexperia.com/documents/data-sheet/SI2302DS.pdf; Height: 1.1mm; Mouser Part Number: N/A; Mouser Price/Stock: https://www.mouser.com/Search/Refine.aspx?Keyword=N%2FA; RS Part Number: 7983053P; RS Price/Stock: http://uk.rs-online.com/web/p/products/7983053P
J2 J3 = WJ2EDGRC-5.08-2P: Connector; Manufacturer_Name: Ningbo Kangnex; Description: Pluggable System Terminal Block 2P RoHS; Datasheet Link: https://datasheet.lcsc.com/szlcsc/Ningbo-Kangnex-Elec-WJ2EDGRC-5-08-2P_C3697.pdf; Height: 8.3mm; Manufacturer_Part_Number: WJ2EDGRC-5.08-2P
PS1 = URB2412LD-30WR3: 金升阳隔离电源; Manufacturer_Name: Mornsun; Manufacturer_Part_Number: URB2412LD-30WHR3; Datasheet Link: https://4donline.ihs.com/images/VipMasterIC/IC/MNSN/MNSN-S-A0002273855/MNSN-S-A0002273855-1.pdf?hkey=EF798316E3902B6ED9A73243A3159BB0; Height: 16.8mm
PS2 = URB2405YMD-15WR3: 金升阳隔离电源; Manufacturer_Name: Mornsun; Manufacturer_Part_Number: URB2405YMD-10WR3; Datasheet Link: https://www.mornsun-power.com/html/pdf/URB2405YMD-10WR3.html; Height: 12.2mm
R1 = RES: 贴片电阻; Package: 0805; Supplier: LC; SuppliersPartNumber: C17798

## Nets that join several sheets
GND: Dev (75 pins), MCU (32 pins), Power (12 pins)
VBUS: Dev (10 pins), Power (6 pins)
VCC_3V3: Dev (19 pins), MCU (32 pins), Power (C7.2 C8.2 IC1.2 R1.2)
VCC_12V: Dev (P10.1 P10.2 P10.3 P10.4), Power (5 pins)
NetC41_2: Dev (C41.2 SW2.1), MCU (U1.2)
NetC45_2: Dev (C45.2 SW3.1), MCU (U1.1)
NetIC2_9: Dev (IC2.9), MCU (U1.70)
NetIC2_10: Dev (IC2.10), MCU (U1.69)
NetIC3_7: Dev (IC3.7), MCU (U1.45)
NetIC3_8: Dev (IC3.8), MCU (U1.44)
NetIC3_11: Dev (IC3.11), MCU (U1.43)
NetIC3_13: Dev (IC3.13), MCU (U1.27)
NetIC3_14: Dev (IC3.14), MCU (U1.35)
NetIC3_15: Dev (IC3.15 R12.1), MCU (U1.117)
NetIC3_16: Dev (IC3.16), MCU (U1.126)
NetIC3_17: Dev (IC3.17), MCU (U1.128)
NetIC3_18: Dev (IC3.18), MCU (U1.129)
NetP4_2: Dev (P4.2), MCU (U1.76)
NetP4_3: Dev (P4.3), MCU (U1.81)
NetP5_2: Dev (P5.2), MCU (U1.77)
NetP5_3: Dev (P5.3), MCU (U1.82)
NetP6_2: Dev (P6.2), MCU (U1.78)
NetP6_3: Dev (P6.3), MCU (U1.85)
NetP7_2: Dev (P7.2), MCU (U1.79)
NetP7_3: Dev (P7.3), MCU (U1.86)
NetP8_2: Dev (P8.2), MCU (U1.80)
NetP8_3: Dev (P8.3), MCU (U1.37)
NetP11_1: Dev (P11.1), MCU (U1.12)
NetP11_2: Dev (P11.2), MCU (U1.13)
NetP11_3: Dev (P11.3), MCU (U1.14)
NetP11_4: Dev (P11.4), MCU (U1.15)
NetP13_1: Dev (P13.1), MCU (U1.88)
NetP13_2: Dev (P13.2), MCU (U1.89)
NetP13_3: Dev (P13.3), MCU (U1.90)
NetP13_4: Dev (P13.4), MCU (U1.91)
NetP13_5: Dev (P13.5), MCU (U1.92)
NetP13_6: Dev (P13.6), MCU (U1.93)
NetR8_2: Dev (R8.2), MCU (U1.36)
NetR14_1: Dev (R14.1), MCU (U1.99)
NetR15_1: Dev (R15.1 U2.11), MCU (U1.11)
NetR16_1: Dev (R16.1 U2.12), MCU (U1.10)
NetR22_2: Dev (R22.2), MCU (U1.96)
NetR27_2: Dev (R27.2), MCU (U1.97)
NetR28_2: Dev (R28.2), MCU (U1.98)
NetU1_73: Dev (U4.1), MCU (U1.73)
NetU1_74: Dev (U4.4), MCU (U1.74)
NetU1_114: Dev (U3.1), MCU (U1.114)
NetU1_115: Dev (U3.4), MCU (U1.115)
USB_D_N: Dev (D8.2 R29.1), MCU (U1.103)
USB_D_P: Dev (D9.2 R30.1), MCU (U1.104)